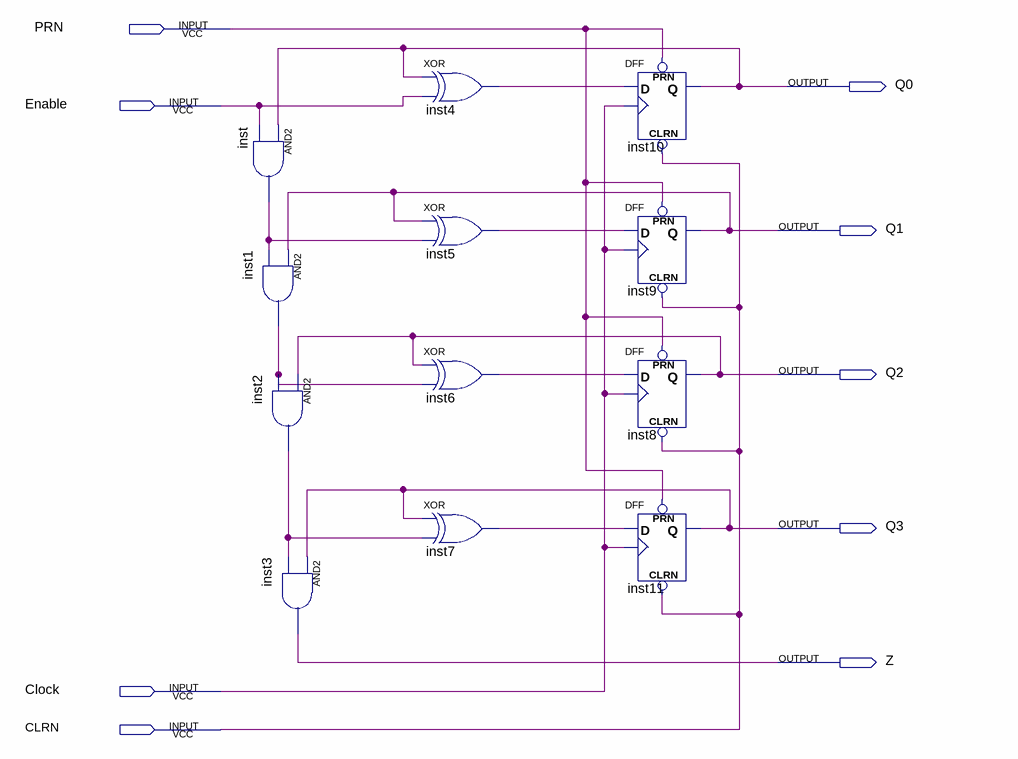
[diagram p0: schematic sheet]
// Quartus schematic lab10step2a.bdf as structural Verilog: 12 symbols, 9 pins
module lab10step2a (
  input  PRN,
  input  Enable,
  input  Clock,
  input  CLRN,
  output Q0,
  output Q1,
  output Q2,
  output Q3,
  output Z
);

  wire inst1_out, inst2_out, inst4_out, inst5_out, inst6_out, inst7_out, inst_out;

  and inst (inst_out, Q0, Enable);
  and inst1 (inst1_out, Q1, inst_out);
  and inst2 (inst2_out, Q2, inst1_out);
  and inst3 (Z, Q3, inst2_out);
  xor inst4 (inst4_out, Q0, Enable);
  xor inst5 (inst5_out, Q1, inst_out);
  xor inst6 (inst6_out, Q2, inst1_out);
  xor inst7 (inst7_out, Q3, inst2_out);
  DFF inst10 (.CLRN(CLRN), .CLK(Clock), .D(inst4_out), .PRN(PRN), .Q(Q0));
  DFF inst9 (.CLRN(CLRN), .CLK(Clock), .D(inst5_out), .PRN(PRN), .Q(Q1));
  DFF inst8 (.CLRN(CLRN), .CLK(Clock), .D(inst6_out), .PRN(PRN), .Q(Q2));
  DFF inst11 (.CLRN(CLRN), .CLK(Clock), .D(inst7_out), .PRN(PRN), .Q(Q3));
endmodule
